# Altium schematic sheet H_bridge.SchDoc
size A4
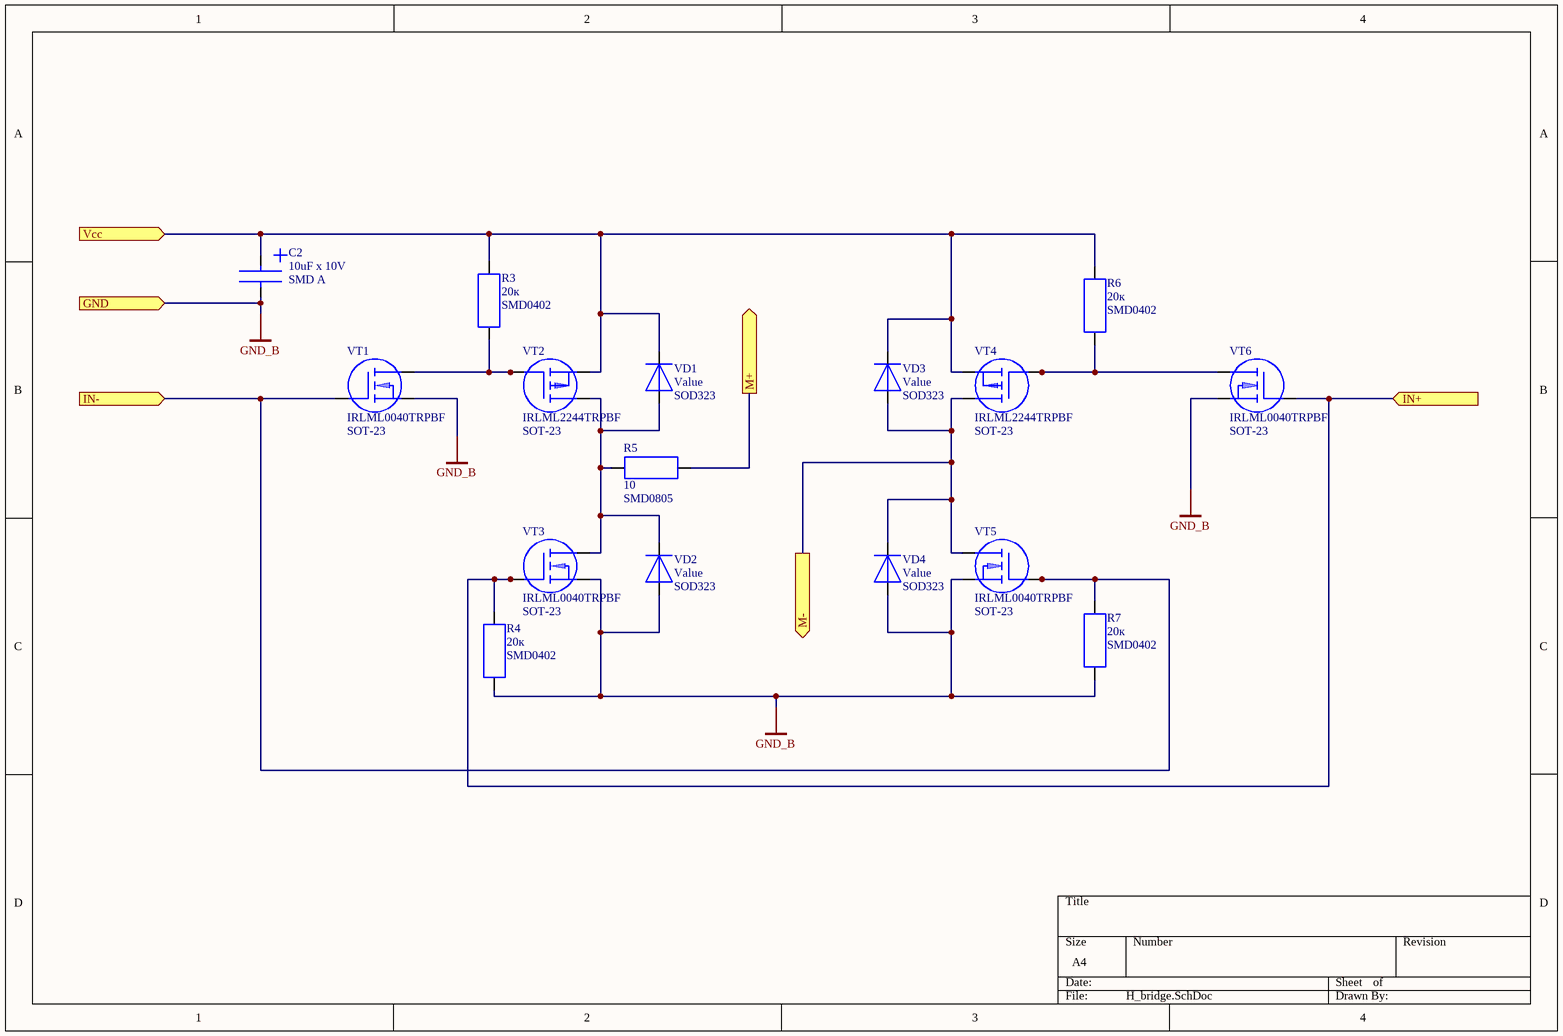
[diagram p0: H_bridge.SchDoc]

## Parts
C2  10uF x 10V  Package: SMD A  [TANT_CAP_A(3216)]
R3  20к  Package: SMD0402  [SMD0402(1608)]
R4  20к  Package: SMD0402  [SMD0402(1608)]
R5  10  Package: SMD0805  [SMD0805(2012)]
R6  20к  Package: SMD0402  [SMD0402(1608)]
R7  20к  Package: SMD0402  [SMD0402(1608)]
VD1  Value  [SOD323]
VD2  Value  [SOD323]
VD3  Value  [SOD323]
VD4  Value  [SOD323]
VT1  IRLML0040TRPBF  Package: SOT-23  [SOT23-3]
VT2  IRLML2244TRPBF  Package: SOT-23  [SOT23-3]
VT3  IRLML0040TRPBF  Package: SOT-23  [SOT23-3]
VT4  IRLML2244TRPBF  Package: SOT-23  [SOT23-3]
VT5  IRLML0040TRPBF  Package: SOT-23  [SOT23-3]
VT6  IRLML0040TRPBF  Package: SOT-23  [SOT23-3]

## Ports
GND (in), IN+ (in), IN- (in), M+ (out), M- (out), Vcc (in)

## Nets
GND_B: C2.2 R4.2 R7.2 VD2.1 VD4.1 VT1.2 VT3.2 VT5.2 VT6.2 ; port GND
IN+: R4.1 VT3.1 VT6.1 ; port IN+
IN-: R7.1 VT1.1 VT5.1 ; port IN-
M+: R5.1 ; port M+
M-: VD3.1 VD4.2 VT4.3 VT5.3 ; port M-
Vcc: C2.1 R3.1 R6.1 VD1.2 VD3.2 VT2.2 VT4.2 ; port Vcc
NetR3_2: R3.2 VT1.3 VT2.1
NetR5_2: R5.2 VD1.1 VD2.2 VT2.3 VT3.3
NetR6_2: R6.2 VT4.1 VT6.3

## Library data of the parts
C2 = C_TANT_A: Type: C; ValueBOM: Конденсатор танталовый 10мкФ х 10В SMD A; Value: 10uF x 10V
R3 R4 R6 R7 = R_0402: ValueBOM: Резистор 20кОм SMD 0402 1%; Type: R; Value: 20к
R5 = R_0805: ValueBOM: Резистор 10 Ом SMD 0805 1%; Type: R; Value: 10
VD1-VD4 = DIODE_SOD323: Type: VD; ValueBOM: Диод Шоттки SOD323; Value: Value; Package: SOD323
VT1 VT3 VT5 VT6 = VT_N_MOSFET_SOT23_3: Type: VT; ValueBOM: Транзистор n-МОП IRLML0040TRPBF SOT23; Value: IRLML0040TRPBF
VT2 VT4 = VT_P_MOSFET_SOT23_3: Type: VT; ValueBOM: Транзистор p-МОП IRLML2244TRPBF SOT23; Value: IRLML2244TRPBF